# Altium schematic sheet RADIOMASTER.SchDoc
size A4
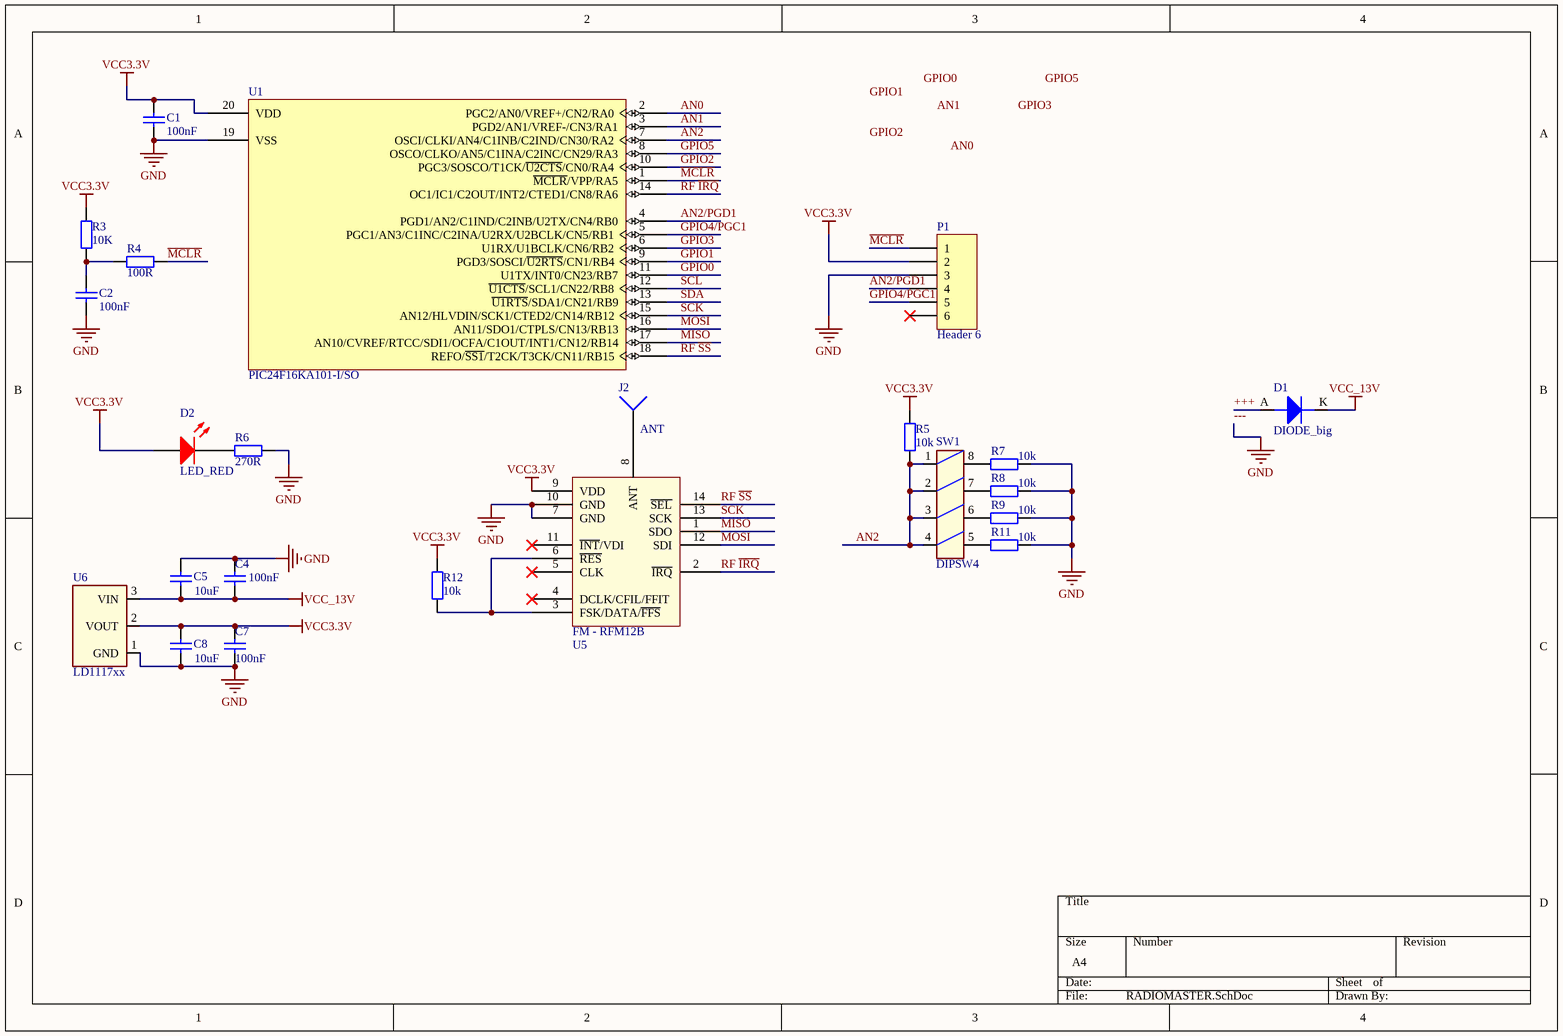
[diagram p0: RADIOMASTER.SchDoc]

## Parts
C1  100nF  [FP_0805_CAP_060]
C2  100nF  [FP_0805_CAP_060]
C4  100nF  [FP_0603_CAP_080]
C5  10uF  [FP_1206_CAP_085]
C7  100nF  [FP_0603_CAP_080]
C8  10uF  [FP_1206_CAP_085]
D1  DIODE_big  [FP_SMA DO214AC]
D2  LED_RED  [FP_0805_LED_RED]
J2  ANT  [PIN1]
P1  Header 6  [HDR1X6]
R3  10K  [FP_0805_RES]
R4  100R  [FP_0805_RES]
R5  10k  [FP_0805_RES]
R6  270R  [FP_0805_RES]
R7  10k  [FP_0805_RES]
R8  10k  [FP_0805_RES]
R9  10k  [FP_0805_RES]
R11  10k  [FP_0805_RES]
R12  10k  [FP_0805_RES]
SW1  DIPSW4  [DIP switch 4 TH]
U1  PIC24F16KA101-I/SO  [SOIC-SO20_N]
U5  RFM12B  [RFM12B-S1]  (value not drawn)
U6  LD1117xx  [SUPPLY_SOT223]

## Nets
---: C1.1 C2.1 C4.1 C5.2 C7.2 C8.1 P1.3 R6.1 R7.1 R8.1 R9.1 R11.1 U1.19(VSS) U5.7(GND) U5.10(GND) U6.1(GND)  [also labelled GND]
VCC3.3V: C1.2 C7.1 C8.2 D2.A P1.2 R3.1 R5.1 R12.2 U1.20(VDD) U5.9(VDD) U6.2(VOUT)
VCC_13V: C4.2 C5.1 D1.K U6.3(VIN)
+++: D1.A
AN0: U1.2(PGC2/AN0/VREF+/CN2/RA0)
AN1: U1.3(PGD2/AN1/VREF-/CN3/RA1)
AN2: R5.2 SW1.1 SW1.2 SW1.3 SW1.4 U1.7(OSCI/CLKI/AN4/C1INB/C2IND/CN30/RA2)
AN2/PGD1: P1.4 U1.4(PGD1/AN2/C1IND/C2INB/U2TX/CN4/RB0)
GPIO0: U1.11(U1TX/INT0/CN23/RB7)
GPIO1: U1.9(PGD3/SOSCI/~{U2RTS}/CN1/RB4)
GPIO2: U1.10(PGC3/SOSCO/T1CK/~{U2CTS}/CN0/RA4)
GPIO3: U1.6(U1RX/U1BCLK/CN6/RB2)
GPIO4/PGC1: P1.5 U1.5(PGC1/AN3/C1INC/C2INA/U2RX/U2BCLK/CN5/RB1)
GPIO5: U1.8(OSCO/CLKO/AN5/C1INA/C2INC/CN29/RA3)
~{MCLR}: P1.1 R4.1 U1.1(~{MCLR}/VPP/RA5)
MISO: U1.17(AN10/CVREF/RTCC/SDI1/OCFA/C1OUT/INT1/CN12/RB14) U5.1(SDO)
MOSI: U1.16(AN11/SDO1/CTPLS/CN13/RB13) U5.12(SDI)
RF ~{IRQ}: U1.14(OC1/IC1/C2OUT/INT2/CTED1/CN8/RA6) U5.2(~{IRQ})
RF ~{SS}: U1.18(REFO/~{SS1}/T2CK/T3CK/CN11/RB15) U5.14(~{SEL})
SCK: U1.15(AN12/HLVDIN/SCK1/CTED2/CN14/RB12) U5.13(SCK)
SCL: U1.12(~{U1CTS}/SCL1/CN22/RB8)
SDA: U1.13(~{U1RTS}/SDA1/CN21/RB9)
NetC2_2: C2.2 R3.2 R4.2
NetD2_K: D2.K R6.2
NetJ2_1: J2.1 U5.8(ANT)
NetR7_2: R7.2 SW1.8
NetR8_2: R8.2 SW1.7
NetR9_2: R9.2 SW1.6
NetR11_2: R11.2 SW1.5
NetR12_1: R12.1 U5.3(FSK/DATA/~{FFS}) U5.6(~{RES})

Not connected (* = marked no-connect by the designer): P1 6*; U5 4(DCLK/CFIL/FFIT)* 5(CLK)* 11(~{INT}/VDI)*

## Notes on the sheet
- Labels drawn without touching a wire or pin: AN0, AN1, GPIO0, GPIO1, GPIO2, GPIO3, GPIO5
- (in symbol RFM12B) FM - RFM12B

## Library data of the parts
C1 C2 C4 C7 = Cap: Capacitor; Order info: TODO; Tűrés: 10%; Published: 8-Jun-2000; LatestRevisionDate: 17-Jul-2002; LatestRevisionNote: Re-released for DXP Platform.; PackageReference: RAD-0.3; Publisher: Altium Limited; Value: 100nF
C5 C8 = Cap: Capacitor; Value: 100nF; Tűrés: 20% X7R; Order info: TODO; Published: 8-Jun-2000; LatestRevisionDate: 17-Jul-2002; LatestRevisionNote: Re-released for DXP Platform.; PackageReference: RAD-0.3; Publisher: Altium Limited; Order info: 82-07-81
D2 = LED_R: Typical LED
J2 = Socket: LatestRevisionDate: 17-Jul-2002; LatestRevisionNote: Re-released for DXP Platform.; Publisher: Altium Limited
P1 = Header 6: Header, 6-Pin; LatestRevisionDate: 17-Jul-2002; LatestRevisionNote: Re-released for DXP Platform.; Publisher: Altium Limited
R3-R9 R11 R12 = Res3: Resistor; Value: 1k; Order info: TODO; Tűrés: 5%; Published: 8-Jun-2000; LatestRevisionDate: 04-Mar-2005; LatestRevisionNote: PCB Footprint replaced.; PackageReference: J1-0603; Publisher: Altium Limited
U1 = PIC24F16KA101-I/SO: 16-Bit Flash Microcontroller with nanoWatt XLP Technology, 16KB Flash, 1.5KB SRAM, 20-Pin SOIC, Industrial Temperature; FirstPublished: 2-Dec-2009; DatasheetVersion: revB, Mar-2009; PackageVersion: revBB, Aug-2009; PackageReference: SOIC-SO20; Publisher: Altium Limited; PackageDescription: 20-Lead Plastic Small Outline (SO) - Wide 7.50mm Body [SOIC]; Supplier 1: Digi-Key; Supplier Part Number 1: PIC24F16KA101-I/SO-ND; Supplier 2: Farnell; Supplier Part Number 2: 1707627; Supplier 3: Newark; Supplier Part Number 3: 40M1459; Code_JEDEC: MS-013-AC; Code_IPC: SOIC127P1030-20; ComponentLink1Description: Datasheet; ComponentLink1URL: http://ww1.microchip.com/downloads/en/DeviceDoc/PIC24F16KA102_Family_datasheet_39927b.pdf; ComponentLink2Description: Packaging Specification; ComponentLink2URL: http://www.microchip.com/stellent/groups/techpub_sg/documents/packagingspec/en012702.pdf; ComponentLink3Description: Microchip.com Home; ComponentLink3URL: http://www.microchip.com/
U5 = RFM12B: FM Module
U6 = LD1117xx: LD1117xx 3,3V lin reg; Order info: TODO; Order info: http://hu.mouser.com/ProductDetail/NXP/NX1117C33Z115/?qs=%2fha2pyFadui8%252bOpsKr9N%2fhvfdxjCMx%252bF0NTwqG%252bWOJY%3d